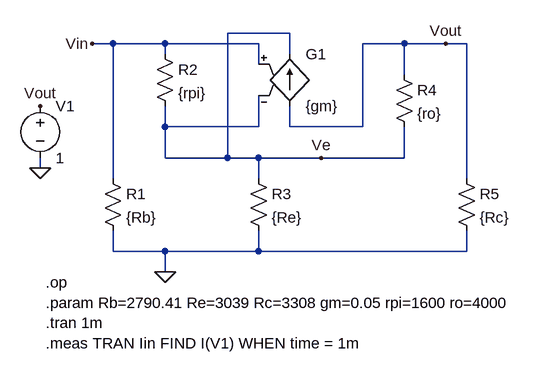
[diagram p0: schematic CE-degen-rout.asc]
CE-degen-rout.asc, the LTspice schematic file:
Version 4
SHEET 1 1048 680
WIRE 528 128 432 128
WIRE 256 144 224 144
WIRE 336 144 256 144
WIRE 480 144 336 144
WIRE 704 144 640 144
WIRE 768 144 704 144
WIRE 800 144 768 144
WIRE 336 160 336 144
WIRE 528 160 528 128
WIRE 480 176 480 144
WIRE 704 192 704 144
WIRE 336 272 336 240
WIRE 480 272 480 224
WIRE 480 272 336 272
WIRE 528 272 528 240
WIRE 640 272 640 144
WIRE 640 272 528 272
WIRE 336 320 336 272
WIRE 432 320 432 128
WIRE 432 320 336 320
WIRE 480 320 432 320
WIRE 576 320 480 320
WIRE 704 320 704 272
WIRE 704 320 576 320
WIRE 144 336 144 320
WIRE 256 352 256 144
WIRE 480 352 480 320
WIRE 800 352 800 144
WIRE 256 464 256 432
WIRE 336 464 256 464
WIRE 480 464 480 432
WIRE 480 464 336 464
WIRE 800 464 800 432
WIRE 800 464 480 464
WIRE 336 496 336 464
FLAG 336 496 0
FLAG 768 144 Vout
FLAG 576 320 Ve
FLAG 224 144 Vin
FLAG 144 336 0
FLAG 144 240 Vout
SYMBOL res 320 144 R0
SYMATTR InstName R2
SYMATTR Value {rpi}
SYMBOL res 464 336 R0
SYMATTR InstName R3
SYMATTR Value {Re}
SYMBOL res 688 176 R0
SYMATTR InstName R4
SYMATTR Value {ro}
SYMBOL res 784 336 R0
SYMATTR InstName R5
SYMATTR Value {Rc}
SYMBOL g 528 144 R0
SYMATTR InstName G1
SYMATTR Value {gm}
SYMBOL voltage 144 224 R0
SYMATTR InstName V1
SYMATTR Value 1
SYMBOL Res 240 336 R0
SYMATTR InstName R1
SYMATTR Value {Rb}
TEXT 152 512 Left 2 !.op\n.param Rb=2790.41 Re=3039 Rc=3308 gm=0.05 rpi=1600 ro=4000\n.tran 1m\n.meas TRAN Iin FIND I(V1) WHEN time = 1m

The netlist it stands for:
* CE-degen-rout.asc
R2 Vin Ve {rpi}
R3 Ve 0 {Re}
R4 Vout Ve {ro}
R5 Vout 0 {Rc}
G1 Vout Ve Vin Ve {gm}
V1 Vout 0 1
R1 Vin 0 {Rb}
.op
.param Rb=2790.41 Re=3039 Rc=3308 gm=0.05 rpi=1600 ro=4000
.tran 1m
.meas TRAN Iin FIND I(V1) WHEN time = 1m
.backanno
.end